# EAGLE design M112D (EAGLE 6.6.0)
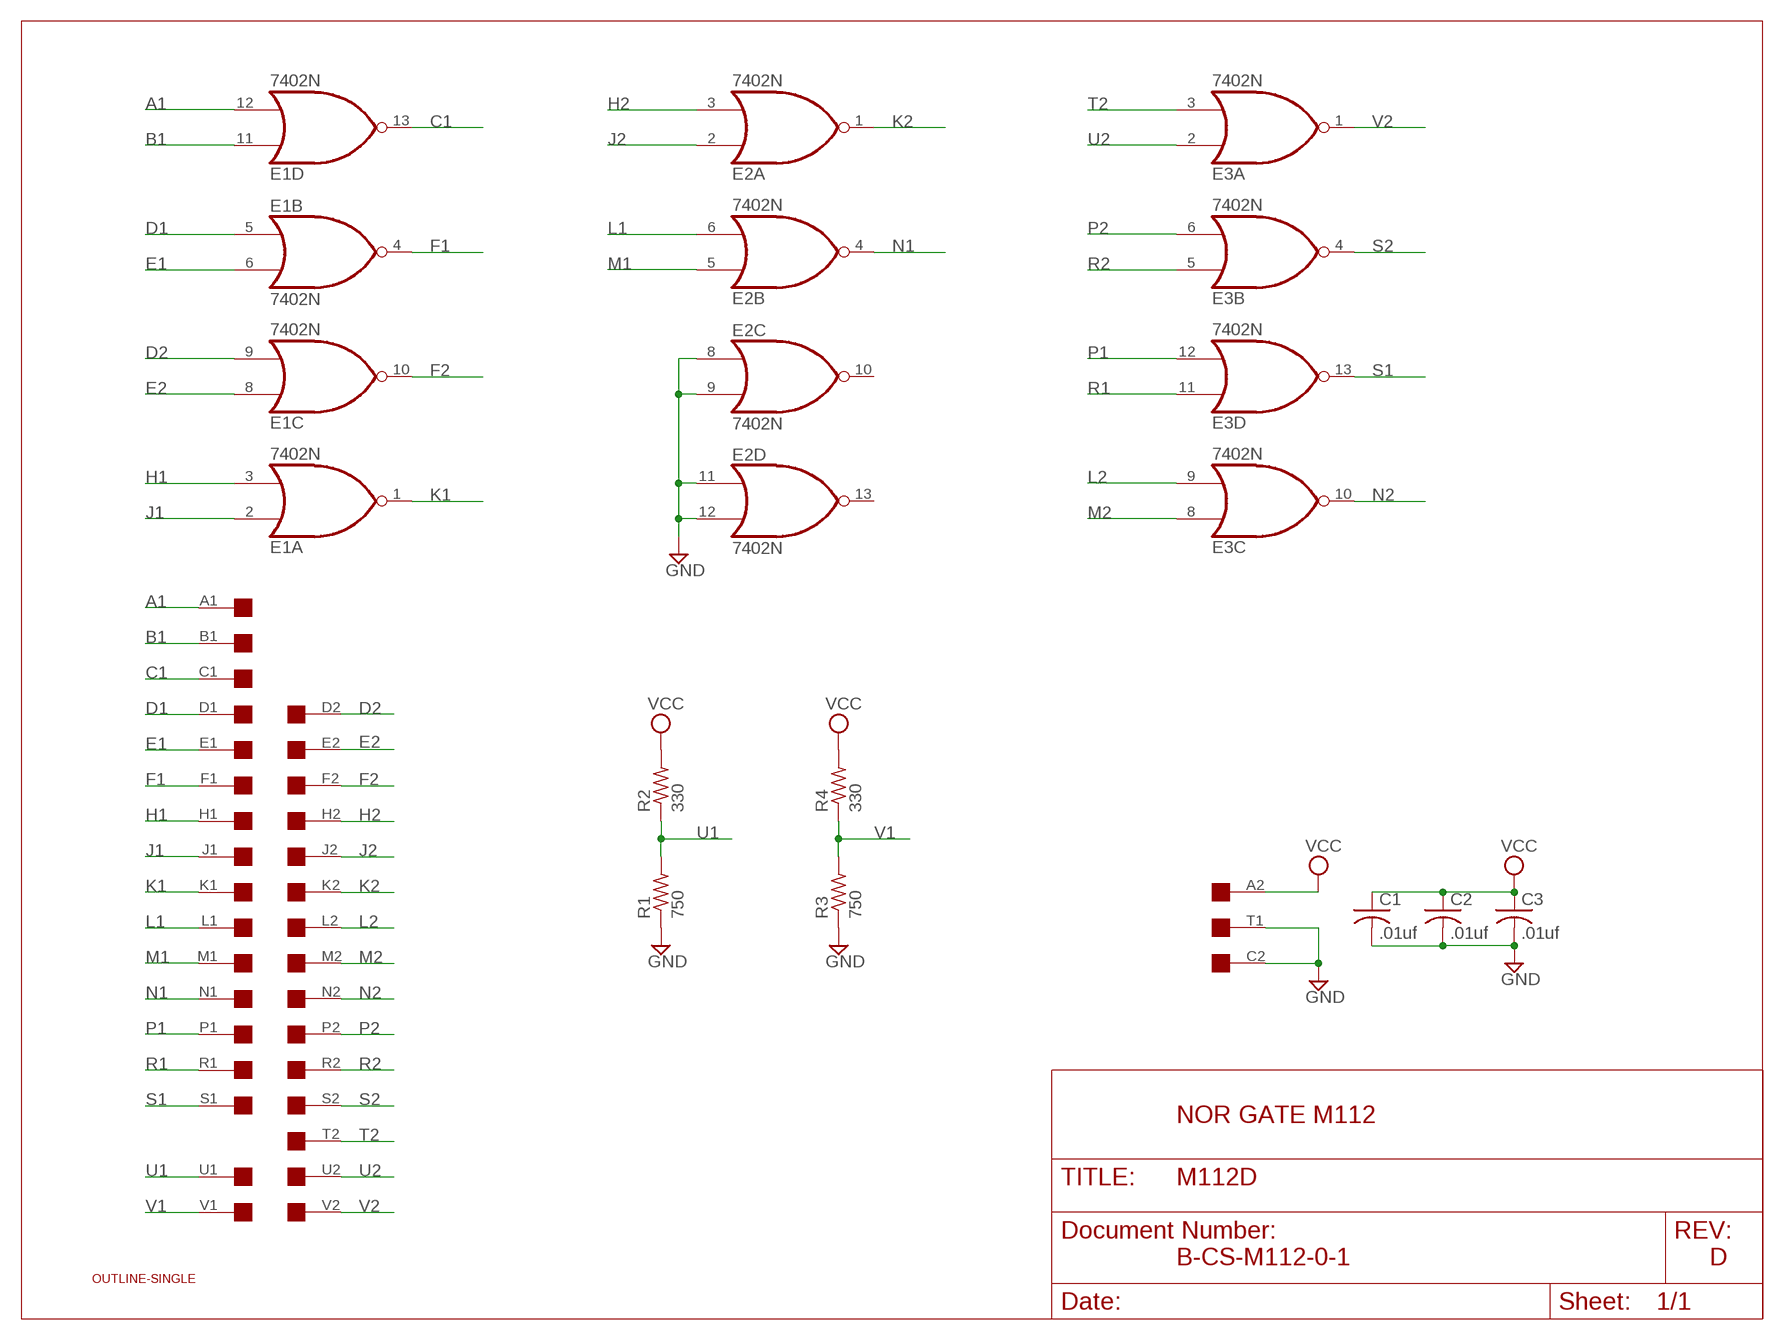
[diagram p0: schematic, sheet 1]

## Parts
C1  .01uf  C-US050-025X075  [C050-025X075]
C2  .01uf  C-US050-025X075  [C050-025X075]
C3  .01uf  C-US050-025X075  [C050-025X075]
E1  7402N  [DIL14]
E2  7402N  [DIL14]
E3  7402N  [DIL14]
R1  750  R-US_0207/10  [0207/10]
R2  330  R-US_0207/10  [0207/10]
R3  750  R-US_0207/10  [0207/10]
R4  330  R-US_0207/10  [0207/10]
U$1  SINGLE  [EDGE-CON2]
U$4  OUTLINE-SINGLE  [SINGLE]

## Nets
A1: E1.12(D:I1) U$1.A1
B1: E1.11(D:I0) U$1.B1
C1: E1.13(D:O) U$1.C1
D1: E1.5(B:I0) U$1.D1
D2: E1.9(C:I1) U$1.D2
E1: E1.6(B:I1) U$1.E1
E2: E1.8(C:I0) U$1.E2
F1: E1.4(B:O) U$1.F1
F2: E1.10(C:O) U$1.F2
GND [Supply]: C1.2 C2.2 C3.2 E2.8(C:I0) E2.9(C:I1) E2.11(D:I0) E2.12(D:I1) R1.1 R3.1 U$1.C2 U$1.T1
H1: E1.3(A:I1) U$1.H1
H2: E2.3(A:I1) U$1.H2
J1: E1.2(A:I0) U$1.J1
J2: E2.2(A:I0) U$1.J2
K1: E1.1(A:O) U$1.K1
K2: E2.1(A:O) U$1.K2
L1: E2.6(B:I1) U$1.L1
L2: E3.9(C:I1) U$1.L2
M1: E2.5(B:I0) U$1.M1
M2: E3.8(C:I0) U$1.M2
N1: E2.4(B:O) U$1.N1
N2: E3.10(C:O) U$1.N2
P1: E3.12(D:I1) U$1.P1
P2: E3.6(B:I1) U$1.P2
R1: E3.11(D:I0) U$1.R1
R2: E3.5(B:I0) U$1.R2
S1: E3.13(D:O) U$1.S1
S2: E3.4(B:O) U$1.S2
T2: E3.3(A:I1) U$1.T2
U1: R1.2 R2.1 U$1.U1
U2: E3.2(A:I0) U$1.U2
V1: R3.2 R4.1 U$1.V1
V2: E3.1(A:O) U$1.V2
VCC [Supply]: C1.1 C2.1 C3.1 R2.2 R4.2 U$1.A2
Unconnected: E2.10(C:O) E2.13(D:O) U$1.B2

## Notes on the sheet
- NOR GATE M112
- B-CS-M112-0-1 | D

## Power pins joined to a net without a drawn wire
GND: E1.7(P:GND) E2.7(P:GND) E3.7(P:GND)
VCC: E1.14(P:VCC) E2.14(P:VCC) E3.14(P:VCC)

## Library data of the parts
C1-C3 = rcl:C-US: CAPACITOR, American symbol
E1-E3 = 74xx-us:74*02: Quad 2-input NOR gate
R1-R4 = rcl:R-US_: RESISTOR, American symbol
U$1 = dec-con:SINGLE: Single-Height DEC board
U$4 = dec-con:OUTLINE-*: Board outlines for DEC boards.

## Net classes
1 Supply: width 0.813 mm

## Board
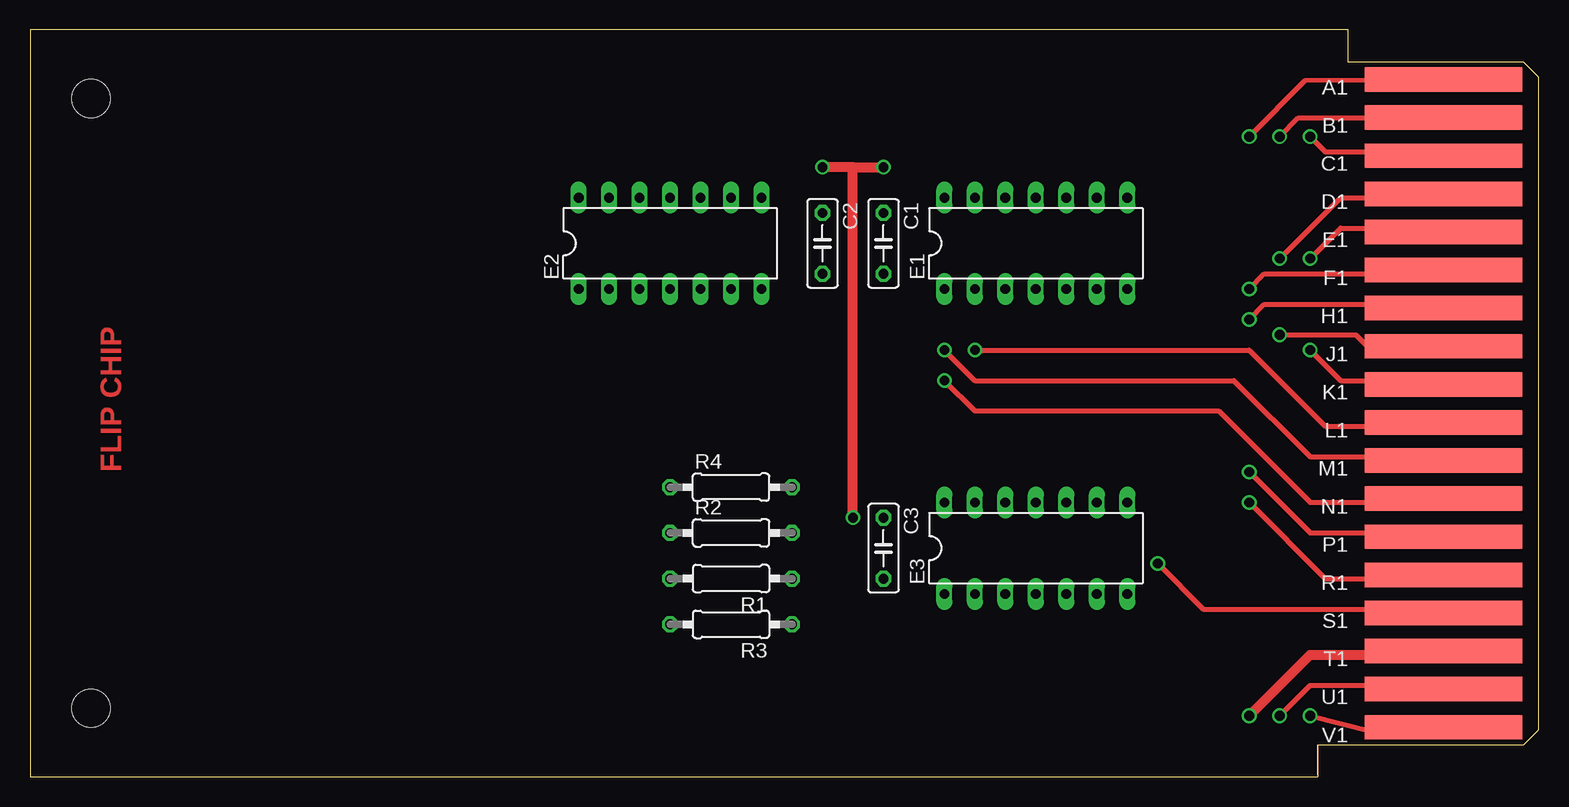
[diagram p1: board, top side]
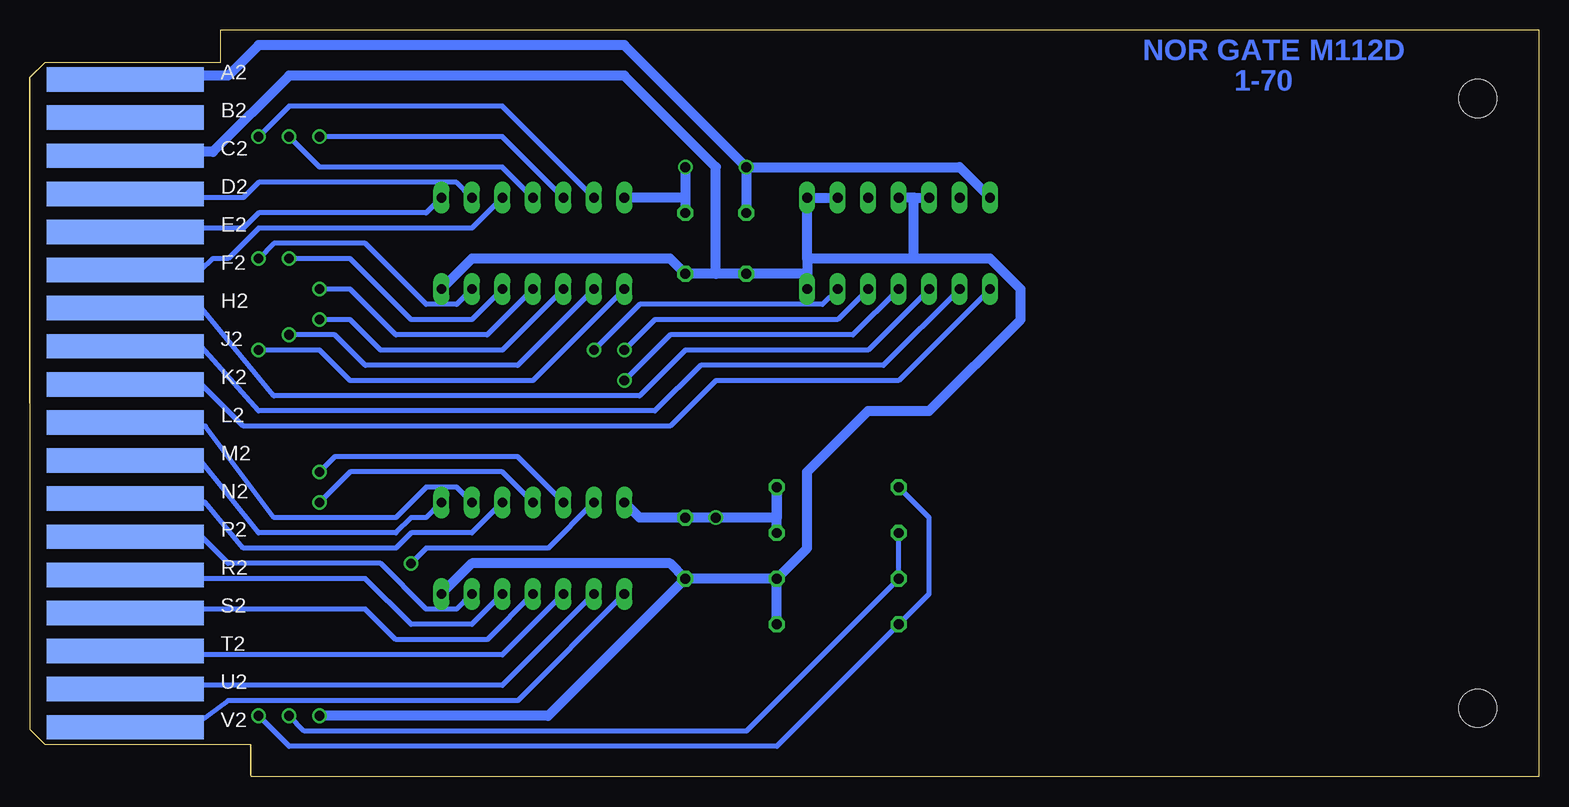
[diagram p2: board, bottom side, seen from below]

Size 125.73 x 62.23 mm. Coordinates in mm from the lower left corner, seen from the top.
Copper layers (1+16): Top 0.035mm / dielectric 1.5mm / Bottom 0.035mm
Design rules "16mils": minimum track width 16mil, minimum drill 32mil, track to track 15mil, track to pad 10mil, pad to pad 10mil, via to via 10mil, smd to smd 10mil, copper to edge 13mil, drill to drill 10mil, minimum pad ring 10mil, minimum via ring 8mil, stop-mask expansion 0mil, vias tented up to drill 0mil, thermal gap 10mil

### Footprints (pad centres in the part's own frame; a part is rotated, then mirrored left to right if it is on the bottom)
C050-025X075 = drill 0.813 octagon: 1 -2.54,0; 2 2.54,0
DIL14 = drill 0.813 long: 1 -7.62,-3.81; 2 -5.08,-3.81; 3 -2.54,-3.81; 4 0,-3.81; 5 2.54,-3.81; 6 5.08,-3.81; 7 7.62,-3.81; 8 7.62,3.81; 9 5.08,3.81; 10 2.54,3.81; 11 0,3.81; 12 -2.54,3.81; 13 -5.08,3.81; 14 -7.62,3.81
0207/10 = drill 0.813 octagon: 1 -5.08,0; 2 5.08,0
EDGE-CON2 = smd 13.106 x 2.032: A1 7.938,4.128; B1 7.938,7.303; C1 7.938,10.477; D1 7.938,13.652; E1 7.938,16.828; F1 7.938,20.003; H1 7.938,23.177; J1 7.938,26.352; K1 7.938,29.527; L1 7.938,32.703; M1 7.938,35.877; N1 7.938,39.053; P1 7.938,42.227; R1 7.938,45.403; S1 7.938,48.578; T1 7.938,51.752; U1 7.938,54.928; V1 7.938,58.102 | smd 13.106 x 2.032 bottom: A2 7.938,4.128; B2 7.938,7.303; C2 7.938,10.477; D2 7.938,13.652; E2 7.938,16.828; F2 7.938,20.003; H2 7.938,23.177; J2 7.938,26.352; K2 7.938,29.527; L2 7.938,32.703; M2 7.938,35.877; N2 7.938,39.053; P2 7.938,42.227; R2 7.938,45.403; S2 7.938,48.578; T2 7.938,51.752; U2 7.938,54.928; V2 7.938,58.102
SINGLE = hole 3.175: 120.65,56.515; 120.65,5.715

### Placement (x,y rotation side)
C1  71.12,44.45 270 top
C2  66.04,44.45 270 top
C3  71.12,19.05 270 top
E1  83.82,44.45 0 top
E2  53.34,44.45 0 top
E3  83.82,19.05 0 top
R1  58.42,16.51 180 top
R2  58.42,20.32 0 top
R3  58.42,12.7 180 top
R4  58.42,24.13 0 top
U$1  125.73,62.23 180 top
U$4  125.73,62.23 180 top

### Tracks (layer width: path | path; a pad name or v marks a point on that pad's centre or on a via)
A1  (via drill 0.81)
  Top 0.406: U$1.A1 106.28,58.02 v101.6,53.34
  Bottom 0.406: v101.6,53.34 86.36,53.34 E1.12
B1  (via drill 0.81)
  Top 0.406: U$1.B1 105.7,54.9 v104.14,53.34
  Bottom 0.406: v104.14,53.34 101.6,50.8 86.36,50.8 E1.11
C1  (via drill 0.81)
  Top 0.406: U$1.C1 112.09,51.74 111.76,52.07 107.95,52.07 v106.68,53.34
  Bottom 0.406: v106.68,53.34 104.14,55.88 86.36,55.88 E1.13
D1  (via drill 0.81)
  Top 0.406: U$1.D1 111.76,48.26 109.22,48.26 v104.14,43.18
  Bottom 0.406: v104.14,43.18 99.06,43.18 93.98,38.1 88.9,38.1 E1.5
D2
  Bottom 0.406: E1.9 90.17,49.53 106.68,49.53 107.95,48.26 111.76,48.26 112.06,48.56 U$1.D2
E1  (via drill 0.81)
  Top 0.406: U$1.E1 113.36,45.39 113.03,45.72 109.22,45.72 v106.68,43.18
  Bottom 0.406: v106.68,43.18 105.41,44.45 97.79,44.45 92.71,39.37 90.17,39.37 E1.6
E2
  Bottom 0.406: U$1.E2 112.09,45.39 111.76,45.72 107.95,45.72 106.68,46.99 92.71,46.99 E1.8
F1  (via drill 0.81)
  Top 0.406: U$1.F1 112.75,42.19 111.76,41.91 102.87,41.91 v101.6,40.64
  Bottom 0.406: v101.6,40.64 99.06,40.64 95.25,36.83 87.63,36.83 E1.4
F2
  Bottom 0.406: U$1.F2 111.48,42.19 110.49,43.18 109.22,43.18 106.68,45.72 88.9,45.72 E1.10
GND  (via drill 0.81)
  Top 0.813: U$1.T1 111.76,10.16 106.68,10.16 v101.6,5.08
  Bottom 0.813: R1.1 C3.2 | R3.1 R1.1 | v101.6,5.08 82.55,5.08 C3.2 | U$1.C2 112.09,51.74 111.76,52.07 110.49,52.07 104.14,58.42 76.2,58.42 68.58,50.8 68.58,41.91 | 68.58,41.91 C1.2 72.39,43.18 88.9,43.18 E1.7 | 68.58,41.91 C2.2 60.96,41.91 E2.7 60.96,43.18 | 60.96,43.18 E2.8 E2.9 | 52.07,48.26 E2.12 | 52.07,48.26 E2.11 | 52.07,43.18 60.96,43.18 | 52.07,43.18 45.72,43.18 43.18,40.64 43.18,38.1 50.8,30.48 55.88,30.48 60.96,25.4 60.96,19.05 R1.1 | 52.07,43.18 52.07,48.26 | E3.7 88.9,17.78 72.39,17.78 C3.2
H1  (via drill 0.81)
  Top 0.406: U$1.H1 112.09,39.04 111.76,39.37 102.87,39.37 v101.6,38.1
  Bottom 0.406: v101.6,38.1 99.06,38.1 96.52,35.56 86.36,35.56 E1.3
H2
  Bottom 0.406: E2.3 55.88,35.56 71.12,35.56 74.93,31.75 105.41,31.75 111.43,39.04 U$1.H2
J1  (via drill 0.81)
  Top 0.406: U$1.J1 111.43,35.89 110.49,36.83 v104.14,36.83
  Bottom 0.406: v104.14,36.83 100.33,36.83 97.79,34.29 85.09,34.29 E1.2
J2
  Bottom 0.406: E2.2 54.61,34.29 69.85,34.29 73.66,30.48 106.68,30.48 111.45,35.89 U$1.J2
K1  (via drill 0.81)
  Top 0.406: U$1.K1 112.06,32.72 111.76,33.02 109.22,33.02 v106.68,35.56
  Bottom 0.406: v106.68,35.56 101.6,35.56 99.06,33.02 83.82,33.02 E1.1
K2
  Bottom 0.406: E2.1 53.34,33.02 68.58,33.02 72.39,29.21 107.95,29.21 111.76,33.02 112.72,32.72 U$1.K2
L1  (via drill 0.81)
  Top 0.406: U$1.L1 112.7,29.54 111.76,29.21 107.95,29.21 101.6,35.56 v78.74,35.56
  Bottom 0.406: E2.6 59.69,39.37 74.93,39.37 v78.74,35.56
L2
  Bottom 0.406: E3.9 90.17,24.13 92.71,24.13 95.25,21.59 105.41,21.59 111.12,29.21 U$1.L2
M1  (via drill 0.81)
  Top 0.406: U$1.M1 112.09,26.34 111.76,26.67 106.68,26.67 100.33,33.02 78.74,33.02 v76.2,35.56
  Bottom 0.406: E2.5 58.42,38.1 73.66,38.1 v76.2,35.56
M2
  Bottom 0.406: U$1.M2 111.76,26.67 106.68,20.32 95.25,20.32 93.98,21.59 92.71,21.59 E3.8
N1  (via drill 0.81)
  Top 0.406: U$1.N1 112.09,23.19 111.76,22.86 106.68,22.86 99.06,30.48 78.74,30.48 v76.2,33.02
  Bottom 0.406: E2.4 57.15,36.83 72.39,36.83 v76.2,33.02
N2
  Bottom 0.406: E3.10 88.9,20.32 93.98,20.32 95.25,19.05 107.95,19.05 111.12,22.86 U$1.N2
P1  (via drill 0.81)
  Top 0.406: U$1.P1 112.09,19.99 111.76,20.32 106.68,20.32 v101.6,25.4
  Bottom 0.406: v101.6,25.4 100.33,26.67 85.09,26.67 E3.12
P2
  Bottom 0.406: U$1.P2 111.76,20.32 109.22,17.78 96.52,17.78 92.71,13.97 90.17,13.97 E3.6
R1  (via drill 0.81)
  Top 0.406: U$1.R1 112.7,16.84 111.76,16.51 107.95,16.51 v101.6,22.86
  Bottom 0.406: E3.11 86.36,25.4 99.06,25.4 v101.6,22.86
R2
  Bottom 0.406: U$1.R2 111.76,16.51 97.79,16.51 93.98,12.7 88.9,12.7 E3.5
S1  (via drill 0.81)
  Top 0.406: U$1.S1 112.06,13.66 111.76,13.97 97.79,13.97 v93.98,17.78
  Bottom 0.406: v93.98,17.78 92.71,19.05 82.55,19.05 E3.13
S2
  Bottom 0.406: U$1.S2 111.76,13.97 97.79,13.97 95.25,11.43 87.63,11.43 E3.4
T2
  Bottom 0.406: U$1.T2 111.76,10.16 86.36,10.16 E3.3
U1  (via drill 0.81)
  Top 0.406: v104.14,5.08 106.68,7.62 111.76,7.62 U$1.U1
  Bottom 0.406: R2.1 R1.2 66.04,3.81 102.87,3.81 v104.14,5.08
U2
  Bottom 0.406: U$1.U2 111.76,7.62 86.36,7.62 E3.2
V1  (via drill 0.81)
  Top 0.406: U$1.V1 111.76,3.81 v106.68,5.08
  Bottom 0.406: R4.1 50.8,21.59 50.8,15.24 R3.2 63.5,2.54 104.14,2.54 v106.68,5.08
V2
  Bottom 0.406: U$1.V2 112,4.2 111.76,4.45 109.22,6.35 85.09,6.35 E3.1
VCC  (via drill 0.81)
  Top 0.813: 68.58,50.8 v66.04,50.8 | 68.58,50.8 v71.12,50.8 | v68.58,21.59 68.58,50.8
  Bottom 0.813: v66.04,50.8 C2.1 | v71.12,50.8 71.12,48.26 | R2.2 R4.2 63.5,21.59 v68.58,21.59 C3.1 74.93,21.59 E3.14 | U$1.A2 112.16,58.02 111.76,58.42 109.22,58.42 106.68,60.96 76.2,60.96 v66.04,50.8 | 71.12,48.26 C1.1 | 71.12,48.26 E1.14 | E2.14 48.26,50.8 v66.04,50.8

### Text on the board
Top: FLIP CHIP
Bottom: NOR GATE M112D | 1-70